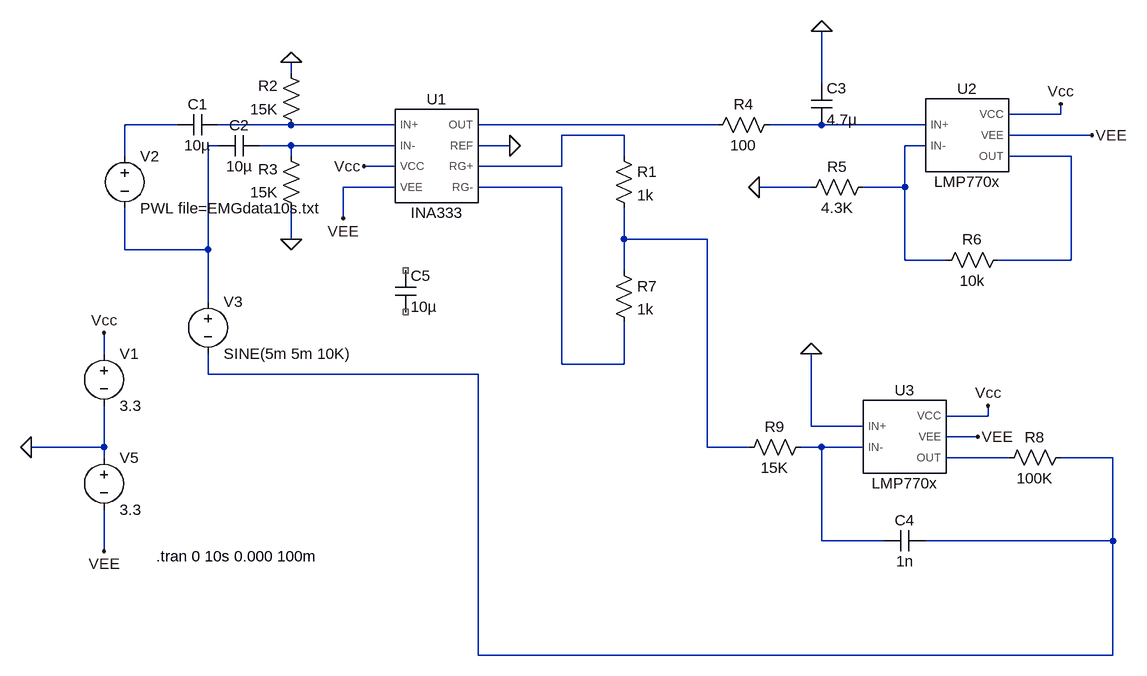
[diagram p0: schematic INA_behavioral.asc]
INA_behavioral.asc, the LTspice schematic file:
Version 4.1
SHEET 1 1260 852
WIRE -32 -48 -32 -64
WIRE 784 -32 784 -112
WIRE 1152 16 1152 0
WIRE 1152 16 1072 16
WIRE -208 32 -288 32
WIRE -32 32 -144 32
WIRE 128 32 -32 32
WIRE 624 32 256 32
WIRE 784 32 704 32
WIRE 944 32 784 32
WIRE 480 48 384 48
WIRE 1200 48 1072 48
WIRE -144 64 -160 64
WIRE -32 64 -80 64
WIRE 128 64 -32 64
WIRE 304 64 256 64
WIRE 944 64 912 64
WIRE -288 80 -288 32
WIRE -32 80 -32 64
WIRE 480 80 480 48
WIRE 1168 80 1072 80
WIRE 128 96 80 96
WIRE 384 96 384 48
WIRE 384 96 256 96
WIRE 128 128 48 128
WIRE 384 128 256 128
WIRE 768 128 688 128
WIRE 912 128 912 64
WIRE 912 128 848 128
WIRE 48 176 48 128
WIRE -32 208 -32 160
WIRE 480 208 480 160
WIRE 608 208 480 208
WIRE -288 224 -288 160
WIRE -160 224 -160 64
WIRE -160 224 -288 224
WIRE 912 240 912 128
WIRE 976 240 912 240
WIRE 1168 240 1168 80
WIRE 1168 240 1056 240
WIRE 480 256 480 208
WIRE -160 304 -160 224
WIRE -320 384 -320 352
WIRE 384 400 384 128
WIRE 480 400 480 336
WIRE 480 400 384 400
WIRE -160 416 -160 384
WIRE 256 416 -160 416
WIRE 1040 480 1040 464
WIRE 1040 480 976 480
WIRE 768 496 768 384
WIRE 848 496 768 496
WIRE 1024 512 976 512
WIRE -320 528 -320 464
WIRE -320 528 -432 528
WIRE 608 528 608 208
WIRE 672 528 608 528
WIRE 784 528 752 528
WIRE 848 528 784 528
WIRE -320 544 -320 528
WIRE 1072 544 976 544
WIRE 1232 544 1152 544
WIRE 784 672 784 528
WIRE 880 672 784 672
WIRE 1232 672 1232 544
WIRE 1232 672 944 672
WIRE -320 688 -320 624
WIRE 256 848 256 416
WIRE 1232 848 1232 672
WIRE 1232 848 256 848
FLAG -320 352 Vcc
FLAG 80 96 Vcc
FLAG -320 688 VEE
FLAG 48 176 VEE
FLAG 304 64 0
FLAG -432 528 0
FLAG 784 -112 0
FLAG 688 128 0
FLAG 1152 0 Vcc
FLAG 1200 48 VEE
FLAG 768 384 0
FLAG 1040 464 Vcc
FLAG 1024 512 VEE
FLAG -32 -64 0
FLAG -32 208 0
SYMBOL INA333 192 80 R0
SYMATTR InstName U1
SYMBOL voltage -320 368 R0
WINDOW 123 0 0 Left 0
WINDOW 39 0 0 Left 0
SYMATTR InstName V1
SYMATTR Value 3.3
SYMBOL res 464 64 R0
SYMATTR InstName R1
SYMATTR Value 1k
SYMBOL voltage -320 528 R0
WINDOW 123 0 0 Left 0
WINDOW 39 0 0 Left 0
SYMATTR InstName V5
SYMATTR Value 3.3
SYMBOL voltage -288 64 R0
WINDOW 123 0 0 Left 0
WINDOW 39 0 0 Left 0
SYMATTR InstName V2
SYMATTR Value PWL file=EMGdata10s.txt
SYMBOL voltage -160 288 R0
WINDOW 123 0 0 Left 0
WINDOW 39 0 0 Left 0
SYMATTR InstName V3
SYMATTR Value SINE(5m 5m 10K)
SYMBOL res -16 48 R180
WINDOW 0 36 76 Left 2
WINDOW 3 36 40 Left 2
SYMATTR InstName R2
SYMATTR Value 15K
SYMBOL res -16 176 R180
WINDOW 0 36 76 Left 2
WINDOW 3 36 40 Left 2
SYMATTR InstName R3
SYMATTR Value 15K
SYMBOL LMP770x 1008 48 R0
SYMATTR InstName U2
SYMBOL res 720 16 R90
WINDOW 0 0 56 VBottom 2
WINDOW 3 32 56 VTop 2
SYMATTR InstName R4
SYMATTR Value 100
SYMBOL cap 768 -32 R0
SYMATTR InstName C3
SYMATTR Value 4.7µ
SYMBOL res 864 112 R90
WINDOW 0 0 56 VBottom 2
WINDOW 3 32 56 VTop 2
SYMATTR InstName R5
SYMATTR Value 4.3K
SYMBOL res 1072 224 R90
WINDOW 0 0 56 VBottom 2
WINDOW 3 32 56 VTop 2
SYMATTR InstName R6
SYMATTR Value 10k
SYMBOL res 464 240 R0
SYMATTR InstName R7
SYMATTR Value 1k
SYMBOL LMP770x 912 512 R0
SYMATTR InstName U3
SYMBOL cap 944 656 R90
WINDOW 0 0 32 VBottom 2
WINDOW 3 32 32 VTop 2
SYMATTR InstName C4
SYMATTR Value 1n
SYMBOL res 1168 528 R90
WINDOW 0 0 56 VBottom 2
WINDOW 3 32 56 VTop 2
SYMATTR InstName R8
SYMATTR Value 100K
SYMBOL res 768 512 R90
WINDOW 0 0 56 VBottom 2
WINDOW 3 32 56 VTop 2
SYMATTR InstName R9
SYMATTR Value 15K
SYMBOL cap 128 256 R0
SYMATTR InstName C5
SYMATTR Value 10µ
SYMBOL cap -144 16 R90
WINDOW 0 0 32 VBottom 2
WINDOW 3 32 32 VTop 2
SYMATTR InstName C1
SYMATTR Value 10µ
SYMBOL cap -80 48 R90
WINDOW 0 0 32 VBottom 2
WINDOW 3 32 32 VTop 2
SYMATTR InstName C2
SYMATTR Value 10µ
TEXT -240 696 Left 2 !.tran 0 10s 0.000 100m

The netlist it stands for:
* INA_behavioral.asc
X§U1 N002 N007 Vcc VEE N003 0 N005 N010 INA333  ; pins IN+ IN- VCC VEE OUT REF RG+ RG-
V1 Vcc 0 3.3
R1 N005 N011 1k
V5 0 VEE 3.3
V2 N001 N006 PWL file=EMGdata10s.txt
V3 N006 N012 SINE(5m 5m 10K)
R2 N002 0 15K
R3 0 N007 15K
X§U2 N004 N008 Vcc VEE N009 LMP770x  ; pins IN+ IN- VCC VEE OUT
R4 N004 N003 100
C3 0 N004 4.7µ
R5 N008 0 4.3K
R6 N009 N008 10k
R7 N011 N010 1k
X§U3 0 N013 Vcc VEE N014 LMP770x  ; pins IN+ IN- VCC VEE OUT
C4 N012 N013 1n
R8 N012 N014 100K
R9 N013 N011 15K
C5 NC_01 NC_02 10µ
C1 N002 N001 10µ
C2 N007 N006 10µ
.tran 0 10s 0.000 100m
.lib E:\Semester 7\06 Medical Electronics\01 Device\Simulations\Medical Electronics\Components\sbom382g\INA333.LIB
.lib E:\Semester 7\06 Medical Electronics\01 Device\Simulations\Medical Electronics\Components\snom105d\LMP770x.LIB
.backanno
.end